# EAGLE design light scanner v1.0 (EAGLE 9.6.2)
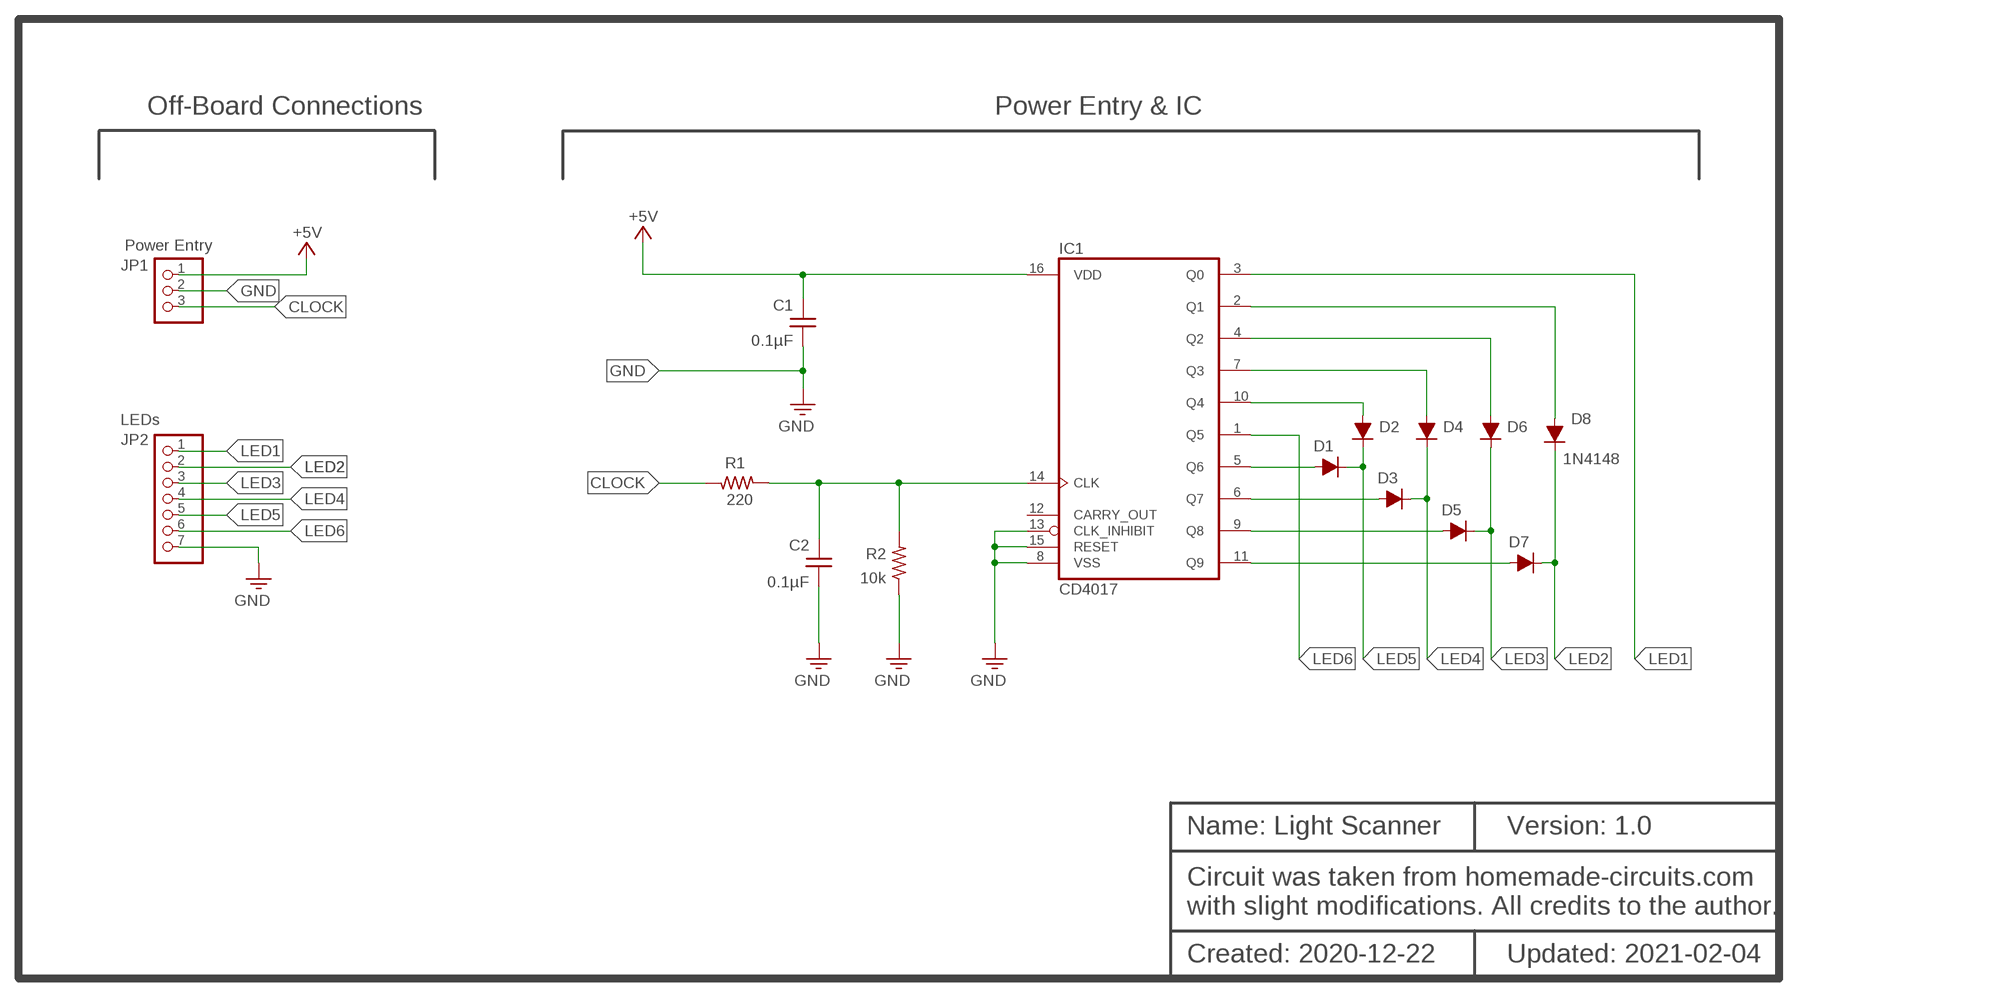
[diagram p0: schematic, sheet 1]

## Parts
C1  0.1µF  C_K104K15X7RF53H5_0.1µF  [C_H5]
C2  0.1µF  C_K104K15X7RF53H5_0.1µF  [C_H5]
D1  D_1N4148  [DO35-7A]
D2  D_1N4148  [DO35-7A]
D3  D_1N4148  [DO35-7A]
D4  D_1N4148  [DO35-7A]
D5  D_1N4148  [DO35-7A]
D6  D_1N4148  [DO35-7A]
D7  D_1N4148  [DO35-7A]
D8  1N4148  D_1N4148  [DO35-7A]
IC1  CD4017  [DIP16]
JP1  Power Entry  PINHD-1X3  [1X03]
JP2  LEDs  PINHD-1X7  [1X07]
R1  220  R_THM  [R_THM]
R2  10k  R_THM  [R_THM]

## Nets
+5V: C1.1 IC1.16(VDD) JP1.1
CLOCK: JP1.3 R1.2
GND: C1.2 C2.2 IC1.8(VSS) IC1.13(CLK_INHIBIT) IC1.15(RESET) JP1.2 JP2.7 R2.1
LED1: IC1.3(Q0) JP2.1
LED2: D7.C D8.C JP2.2
LED3: D5.C D6.C JP2.3
LED4: D3.C D4.C JP2.4
LED5: D1.C D2.C JP2.5
LED6: IC1.1(Q5) JP2.6
N$2: C2.1 IC1.14(CLK) R1.1 R2.2
N$4: D1.A IC1.5(Q6)
N$6: D2.A IC1.10(Q4)
N$7: D3.A IC1.6(Q7)
N$9: D4.A IC1.7(Q3)
N$10: D5.A IC1.9(Q8)
N$12: D6.A IC1.4(Q2)
N$13: D7.A IC1.11(Q9)
N$14: D8.A IC1.2(Q1)
Unconnected: IC1.12(CARRY_OUT)

## Notes on the sheet
- Off-Board Connections | Power Entry & IC
- Name: Light Scanner | Version: 1.0
- Circuit was taken from homemade-circuits.com 
  with slight modifications. All credits to the author.
- Created: 2020-12-22 | Updated: 2021-02-04

## Library data of the parts
C1 C2 = Assys Complex:C_: CAPACITORS
D1-D8 = Assys Complex:D_: DIODES
IC1 = Assys Complex:CD4017: 10-Out Decade Counter Datasheet <https://cdn.sparkfun.com/datasheets/Kits/cd4022b.pdf> SparkFun Products SparkFun SparkPunk Sequencer Kit <https://www.sparkfun.com/products/12707> (KIT-12707); PROD_ID: IC-11929
JP1 = Assys Complex:PINHD-1X3: PIN HEADER
JP2 = Assys Complex:PINHD-1X7: PIN HEADER
R1 R2 = Assys Complex:R_: Resistors

## Board
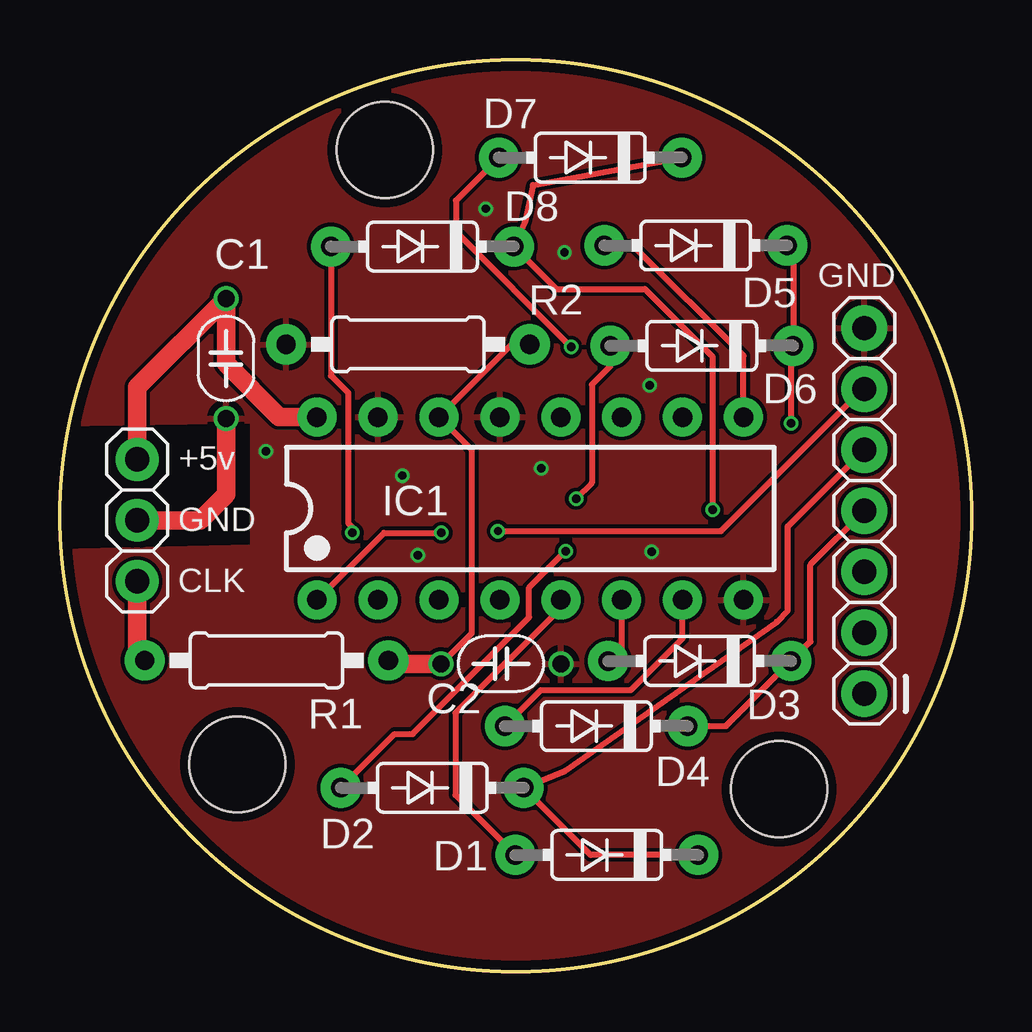
[diagram p1: board, top side]
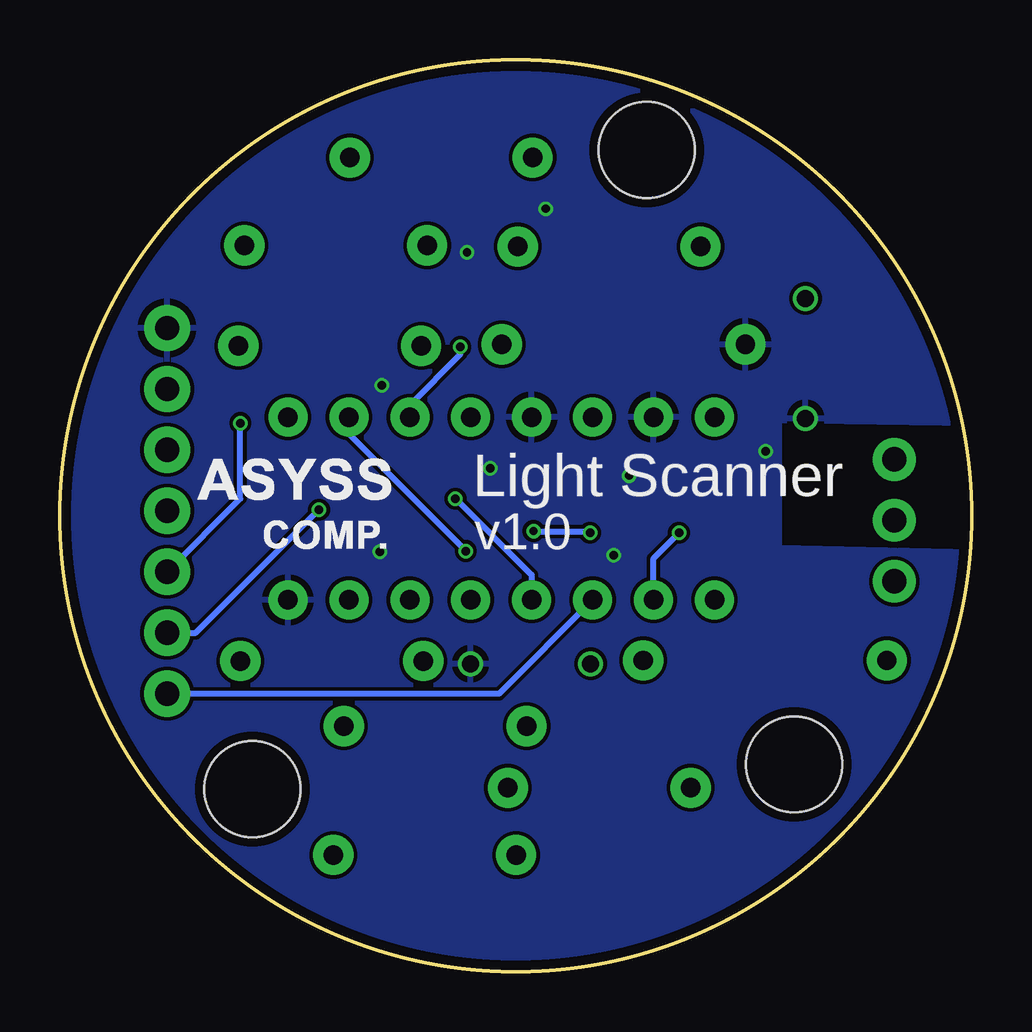
[diagram p2: board, bottom side, seen from below]

Size 38 x 38 mm. Coordinates in mm from the lower left corner, seen from the top.
Outline: circle at 19,19 radius 19
Copper layers (1*16): Top 0.035559375mm / dielectric 1.6mm / Bottom 0.035559375mm
Design rules "oshpark-2layer *": minimum track width 6mil, minimum drill 10mil, track to track 6mil, track to pad 6mil, pad to pad 6mil, via to via 6mil, smd to smd 6mil, copper to edge 15mil, drill to drill 6mil, minimum pad ring 5mil, minimum via ring 5mil, stop-mask expansion 2.5mil, vias tented up to drill 14mil, thermal gap 10mil
Holes 4 mm at 7.39,8.64 13.55,34.25 29.98,7.6

### Footprints (pad centres in the part's own frame; a part is rotated, then mirrored left to right if it is on the bottom)
C_H5 = drill 0.7: 1 -2.5,0; 2 2.5,0
DO35-7A = drill 0.813 pad 1.676: A 3.81,0; C -3.81,0
DIP16 = drill 0.813 pad 1.626: 1 -8.89,-3.81; 2 -6.35,-3.81; 3 -3.81,-3.81; 4 -1.27,-3.81; 5 1.27,-3.81; 6 3.81,-3.81; 7 6.35,-3.81; 8 8.89,-3.81; 9 8.89,3.81; 10 6.35,3.81; 11 3.81,3.81; 12 1.27,3.81; 13 -1.27,3.81; 14 -3.81,3.81; 15 -6.35,3.81; 16 -8.89,3.81
1X03 = drill 1.016 pad 1.778: 1 -2.54,0; 2 0,0; 3 2.54,0
1X07 = drill 1.016 pad 1.93: 1 -7.62,0; 2 -5.08,0; 3 -2.54,0; 4 0,0; 5 2.54,0; 6 5.08,0; 7 7.62,0
R_THM = drill 0.8 pad 1.676: 1 -5.08,0; 2 5.08,0

### Placement (x,y rotation side)
C1  6.92,25.56 270 top
C2  18.38,12.83 0 top
D1  22.79,4.86 180 top
D2  15.52,7.66 180 top
D3  26.67,12.94 180 top
D4  22.36,10.23 180 top
D5  26.5,30.27 180 top
D6  26.76,26.09 180 top
D7  22.11,33.93 180 top
D8  15.11,30.22 180 top
IC1  19.61,19.3 0 top
JP1  3.22,18.81 270 top
JP2  33.53,19.2 90 top
R1  8.61,12.97 180 top
R2  14.51,26.14 0 top
U$2  [ASSYS_COMP_LOGO_V6]  27.26,19.25 0 bottom

### Tracks (layer width: path | path; a pad name or v marks a point on that pad's centre or on a via)
+5V
  Top 0.762: IC1.16 9.14,23.11 6.92,25.34 C1.1 3.22,24.36 JP1.1
CLOCK
  Top 0.762: R1.2 3.22,13.28 JP1.3
GND  (via drill 0.35)
  Top 0.762: JP1.2 5.85,18.81 6.92,19.88 C1.2
  other vias: 8.59,21.69 14.27,20.68 14.91,17.35 24.66,17.5 17.75,31.8 21.03,29.97 24.59,24.43 20.07,20.98
  pour Top: 0,38.1 -0.14,22.85 8.04,22.98 8.04,17.69 -0.12,17.48 -0.12,0 38.1,0 38.1,38.1
  pour Bottom: 0,38.1 -0.14,22.85 8.04,22.98 8.04,17.69 -0.12,17.48 -0.12,0 38.1,0 38.1,38.1
LED1
  Bottom 0.254: IC1.3 19.71,11.58 JP2.1
LED2  (via drill 0.35)
  Top 0.254: D7.C 19.71,32.79 19.38,31.23 D8.C 20.69,28.45 24.38,28.45 27.2,25.63 v27.2,19.25
  Bottom 0.254: JP2.2 32.33,14.12 v27.2,19.25
LED3  (via drill 0.35)
  Top 0.254: D5.C 30.57,30.02 D6.C 30.48,26 v30.48,22.86
  Bottom 0.254: v30.48,22.86 30.48,19.72 JP2.3
LED4
  Top 0.254: JP2.4 31.29,16.96 31.29,13.76 D3.C 27.76,10.23 D4.C
LED5
  Top 0.254: D1.C 22.12,4.86 D2.C 21.06,8.37 29.88,14.58 30.34,15.04 30.34,18.55 JP2.5
LED6  (via drill 0.35)
  Top 0.254: IC1.1 13.51,18.29 v15.9,18.29 | v18.26,18.36 27.56,18.36 33.48,24.28 JP2.6
  Bottom 0.254: v18.26,18.36 18.23,18.34 15.95,18.34 v15.9,18.29
N$2
  Top 0.254: R2.2 18.83,26.14 IC1.14 17.17,21.74 17.17,14.11 C2.1
  Top 0.762: C2.1 13.83,12.83 R1.1
N$4
  Top 0.254: IC1.5 20.88,15.16 16.48,10.77 16.48,7.36 D1.A
N$6  (via drill 0.35)
  Top 0.254: D2.A 13.95,9.91 14.7,9.91 19.56,14.76 19.56,16 v21.08,17.53
  Bottom 0.254: v21.08,17.53 25.96,22.4 IC1.10
N$7
  Top 0.254: IC1.6 23.42,13.5 D3.A
N$9
  Top 0.254: IC1.7 25.96,13.89 23.79,11.73 20.05,11.73 D4.A
N$10
  Top 0.254: IC1.9 28.5,25.67 23.89,30.27 D5.A
N$12  (via drill 0.35)
  Top 0.254: D6.A 22.95,25.23 22.17,24.46 22.17,20.37 v21.51,19.71
  Bottom 0.254: v21.51,19.71 18.34,16.53 IC1.4
N$13  (via drill 0.35)
  Top 0.254: D7.A 16.51,32.14 16.51,30.84 v21.31,26.04
  Bottom 0.254: IC1.11 23.42,23.62 21.31,25.73 v21.31,26.04
N$14  (via drill 0.35)
  Top 0.254: v12.19,18.29 12.19,18.52 12.01,18.7 12.01,24.12 11.3,24.84 D8.A
  Bottom 0.254: IC1.2 13.26,17.22 v12.19,18.29

### Text on the board
tPlace: GND | +5v | GND | CLK
bPlace: Light Scanner | v1.0